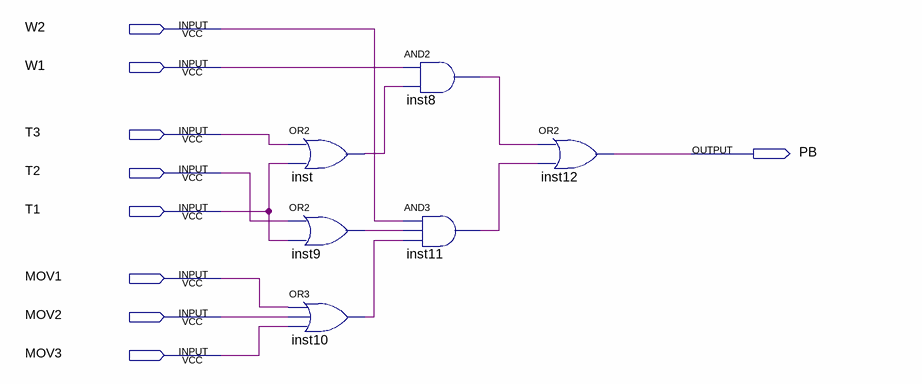
[diagram p0: schematic sheet]
// Quartus schematic PB.bdf as structural Verilog: 6 symbols, 9 pins
module PB (
  input  W2,
  input  W1,
  input  T3,
  input  T2,
  input  T1,
  input  MOV1,
  input  MOV2,
  input  MOV3,
  output PB
);

  wire inst8_out, inst9_out, inst10_out, inst11_out, inst_out;

  or inst (inst_out, T3, T1);
  or inst9 (inst9_out, T2, T1);
  or inst10 (inst10_out, MOV1, MOV2, MOV3);
  and inst8 (inst8_out, W1, inst_out);
  and inst11 (inst11_out, W2, inst9_out, inst10_out);
  or inst12 (PB, inst8_out, inst11_out);
endmodule
